# Altium project H3-core.PrjPcb
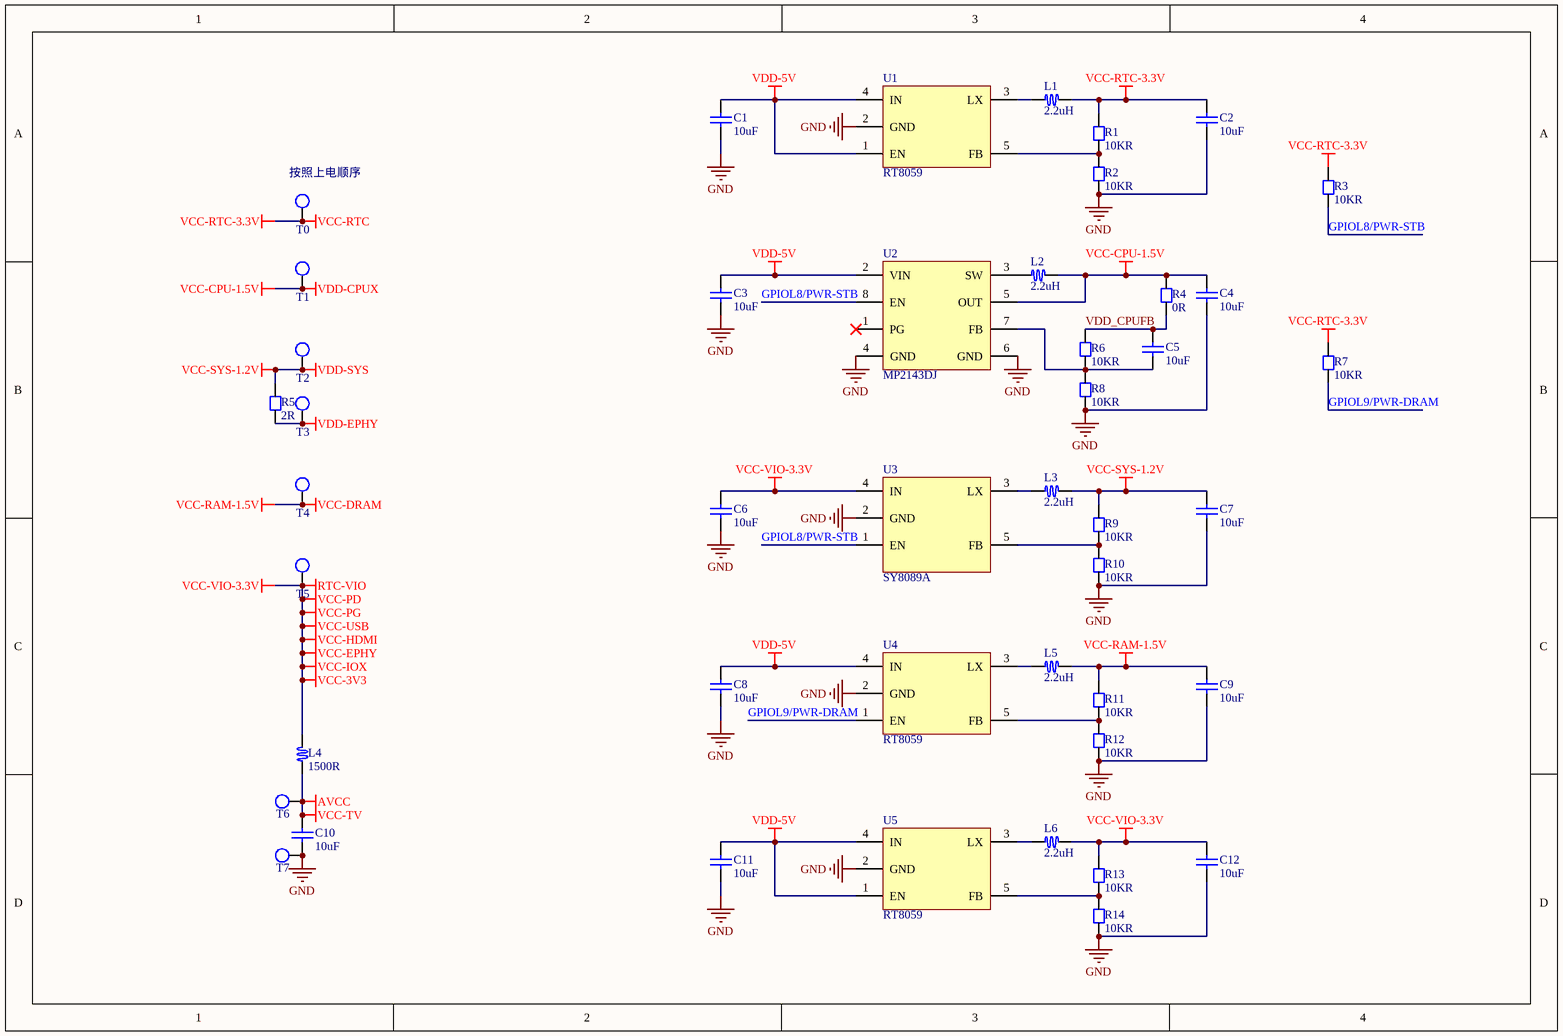
[diagram p0: 1-Power.SchDoc]
4 sheets, 165 parts. Net scope: global (net labels, ports and power ports of the same name join across sheets).
Board files: H3-core.PcbDoc, PCB-Logo.PcbDoc
Sheets:
  1-Power.SchDoc
  2-core.SchDoc
  3-Wifi-SD.SchDoc
  4-Connect.SchDoc

## Sheet 1-Power.SchDoc
size A4; SheetNumber: 1; SheetTotal: 4

### Parts
C1  10uF  [CC1005-0402]
C2  10uF  [CC1005-0402]
C3  10uF  [CC1005-0402]
C4  10uF  [CC1005-0402]
C5  10uF  [CC1005-0402]
C6  10uF  [CC1005-0402]
C7  10uF  [CC1005-0402]
C8  10uF  [CC1005-0402]
C9  10uF  [CC1005-0402]
C10  10uF  [CC1005-0402]
C11  10uF  [CC1005-0402]
C12  10uF  [CC1005-0402]
L1  2.2uH  [Inductor-3010]
L2  2.2uH  [Inductor-4018]
L3  2.2uH  [Inductor-3010]
L4  1500R  [Inductor-0402]
L5  2.2uH  [Inductor-3010]
L6  2.2uH  [Inductor-3010]
R1  10KR  [CR1005-0402]
R2  10KR  [CR1005-0402]
R3  10KR  [CR1005-0402]
R4  0R  [CR1005-0402]
R5  2R  [CR1005-0402]
R6  10KR  [CR1005-0402]
R7  10KR  [CR1005-0402]
R8  10KR  [CR1005-0402]
R9  10KR  [CR1005-0402]
R10  10KR  [CR1005-0402]
R11  10KR  [CR1005-0402]
R12  10KR  [CR1005-0402]
R13  10KR  [CR1005-0402]
R14  10KR  [CR1005-0402]
T0  Test  [TEST]  (value not drawn)
T1  Test  [TEST]  (value not drawn)
T2  Test  [TEST]  (value not drawn)
T3  Test  [TEST]  (value not drawn)
T4  Test  [TEST]  (value not drawn)
T5  Test  [TEST]  (value not drawn)
T6  Test  [TEST]  (value not drawn)
T7  Test  [TEST]  (value not drawn)
U1  RT8059  [SOT23-5]
U2  MP2143DJ  [TSOT23-8]
U3  SY8089A  [SOT23-5]
U4  RT8059  [SOT23-5]
U5  RT8059  [SOT23-5]

### Nets
AVCC: C10.2 L4.1 T6.1  [also labelled VCC-TV]
GND: C1.1 C2.1 C3.1 C4.1 C6.1 C7.1 C8.1 C9.1 C10.1 C11.1 C12.1 R2.1 R8.1 R10.1 R12.1 R14.1 T7.1 U1.2(GND) U2.4(GND) U2.6(GND) U3.2(GND) U4.2(GND) U5.2(GND)
RTC-VIO: C6.2 C12.2 L4.2 L6.2 R13.2 T5.1 U3.4(IN)  [also labelled VCC-3V3, VCC-EPHY, VCC-HDMI, VCC-IOX, VCC-PD, VCC-PG, VCC-USB, VCC-VIO-3.3V]
VCC-CPU-1.5V: C4.2 L2.2 R4.2 T1.1 U2.5(OUT)  [also labelled VDD-CPUX]
VCC-DRAM: C9.2 L5.2 R11.2 T4.1  [also labelled VCC-RAM-1.5V]
VCC-RTC: C2.2 L1.2 R1.2 R3.2 R7.2 T0.1  [also labelled VCC-RTC-3.3V]
VCC-SYS-1.2V: C7.2 L3.2 R5.1 R9.2 T2.1  [also labelled VDD-SYS]
VDD-5V: C1.2 C3.2 C8.2 C11.2 U1.1(EN) U1.4(IN) U2.2(VIN) U4.4(IN) U5.1(EN) U5.4(IN)  [project net USB-5V]
VDD-EPHY: R5.2 T3.1
GPIOL8/PWR-STB: R3.1 U2.8(EN) U3.1(EN)
GPIOL9/PWR-DRAM: R7.1 U4.1(EN)
VDD_CPUFB: C5.2 R4.1 R6.2
NetC5_1: C5.1 R6.1 R8.2 U2.7(FB)
NetL1_1: L1.1 U1.3(LX)
NetL2_1: L2.1 U2.3(SW)
NetL3_1: L3.1 U3.3(LX)
NetL5_1: L5.1 U4.3(LX)
NetL6_1: L6.1 U5.3(LX)
NetR1_1: R1.1 R2.2 U1.5(FB)
NetR9_1: R9.1 R10.2 U3.5(FB)
NetR11_1: R11.1 R12.2 U4.5(FB)
NetR13_1: R13.1 R14.2 U5.5(FB)

Not connected (* = marked no-connect by the designer): U2 1(PG)*

### Notes on the sheet
- (near T0) 按照上电顺序

### Library data of the parts
C1-C12 = Chip capacitor: 贴片电容
L1-L6 = Chip inductor: 贴片电感
R1-R14 = Chip resistor: 贴片电阻
T0-T7 = Test: 测试点
U1 U4 U5 = RT8059: LDO 1A RICHTEK(台湾立锜)
U2 = MP2143DJ: DCDC 3A MPS公司（中文名称：芯源信息系统有限公司）
U3 = SY8089A: DCDC 2A

## Sheet 2-core.SchDoc
size A2; SheetNumber: 2; SheetTotal: 4
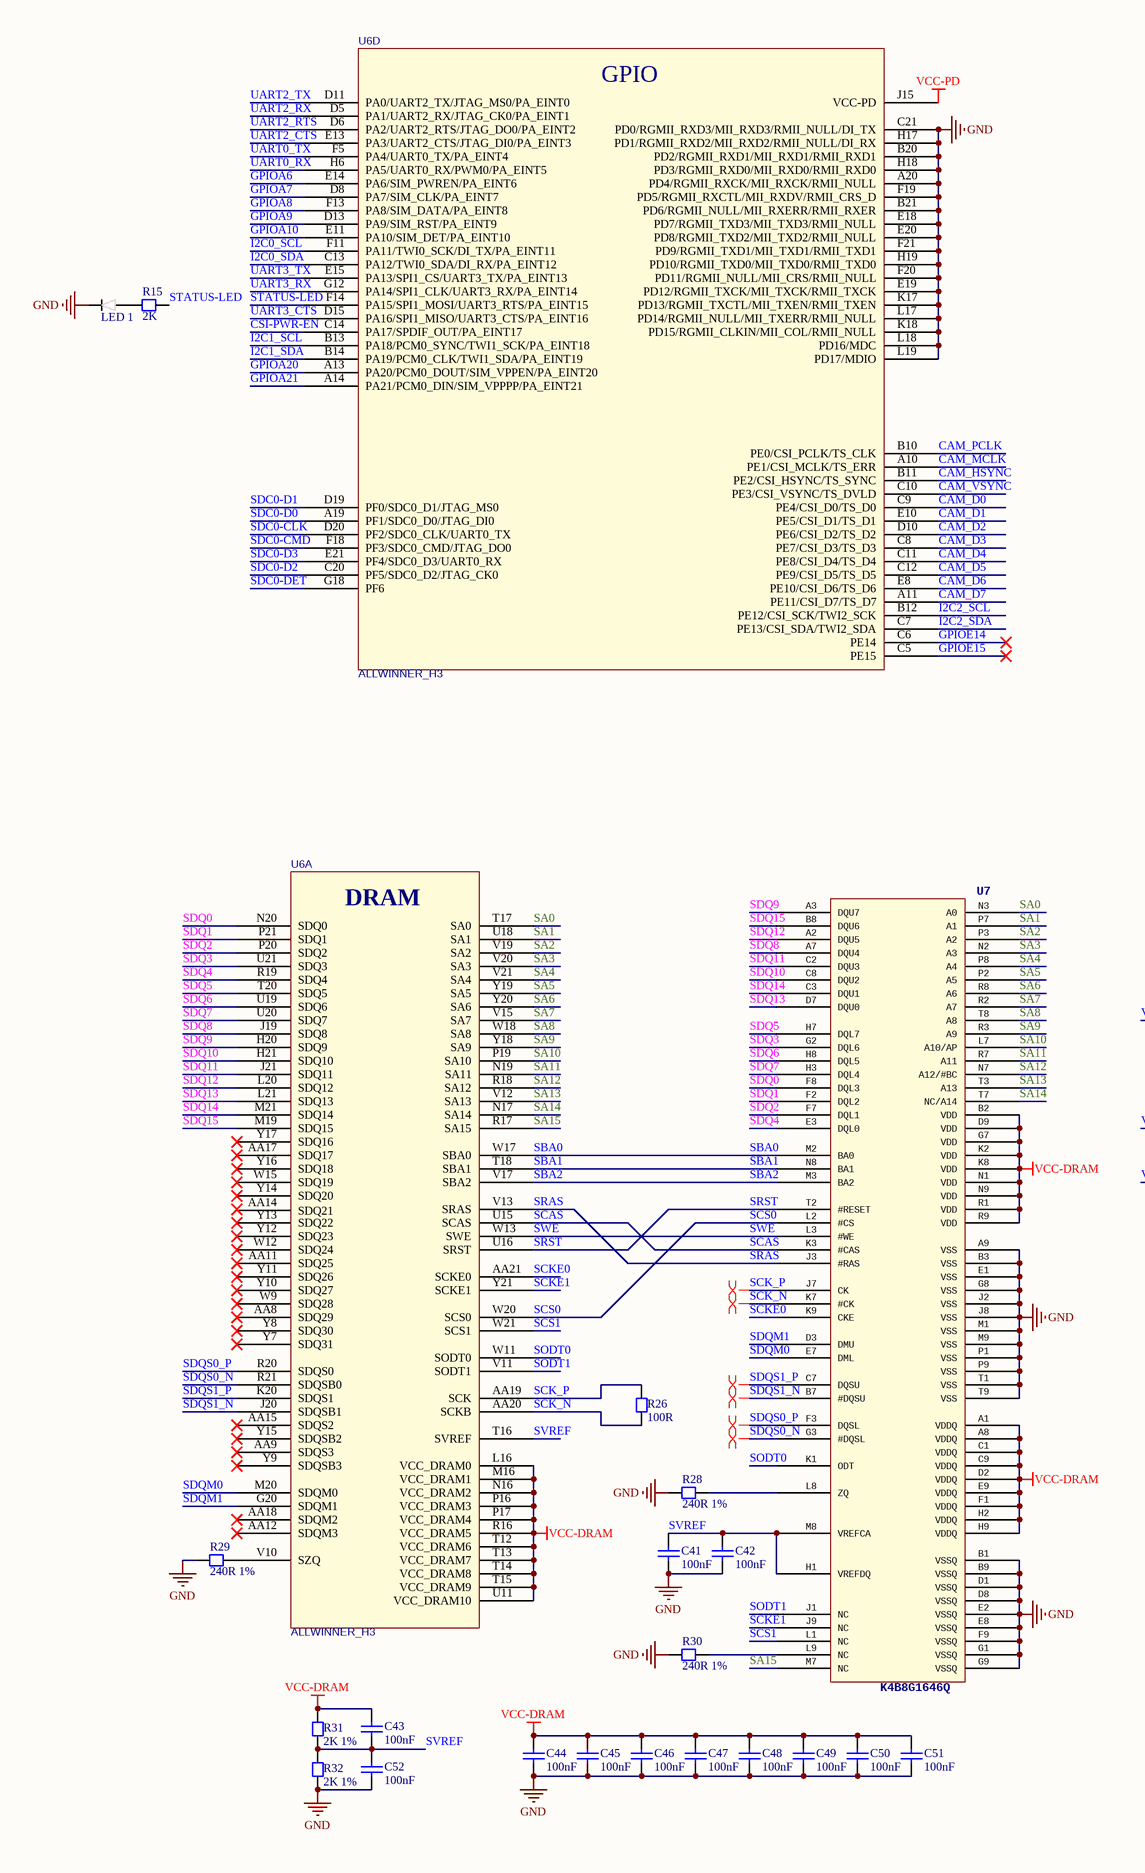
[diagram p1: 2-core.SchDoc, left]
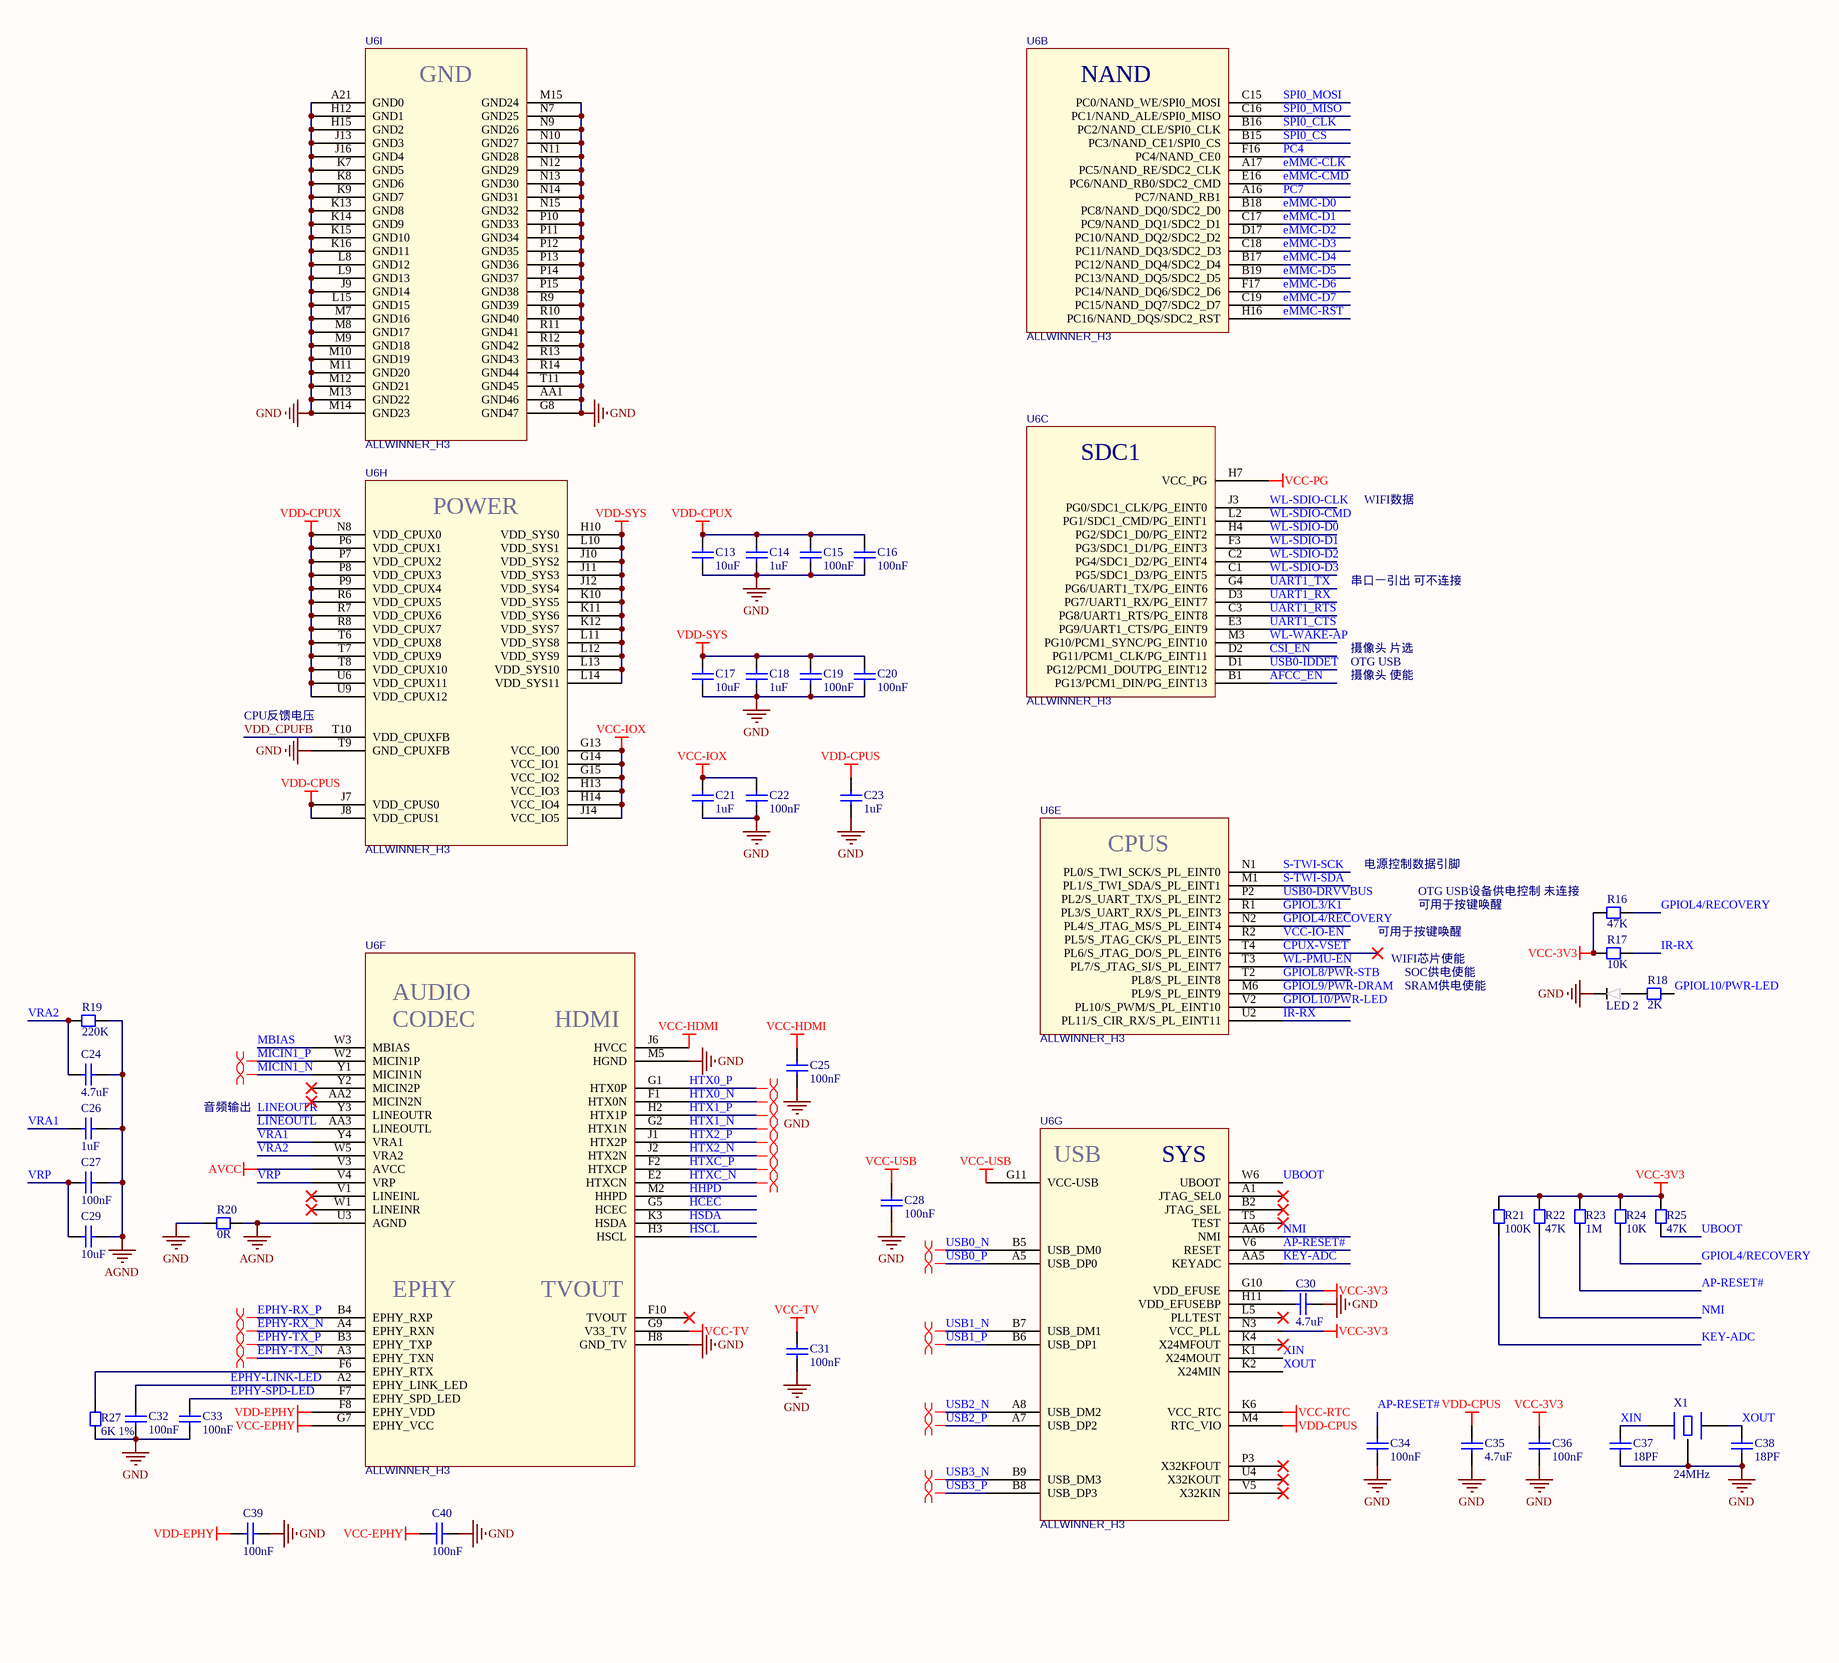
[diagram p2: 2-core.SchDoc, right]

### Parts
C13  10uF  [CC1005-0402]
C14  1uF  [CC1005-0402]
C15  100nF  [CC1005-0402]
C16  100nF  [CC1005-0402]
C17  10uF  [CC1005-0402]
C18  1uF  [CC1005-0402]
C19  100nF  [CC1005-0402]
C20  100nF  [CC1005-0402]
C21  1uF  [CC1005-0402]
C22  100nF  [CC1005-0402]
C23  1uF  [CC1005-0402]
C24  4.7uF  [CC1005-0402]
C25  100nF  [CC1005-0402]
C26  1uF  [CC1005-0402]
C27  100nF  [CC1005-0402]
C28  100nF  [CC1005-0402]
C29  10uF  [CC1005-0402]
C30  4.7uF  [CC1005-0402]
C31  100nF  [CC1005-0402]
C32  100nF  [CC1005-0402]
C33  100nF  [CC1005-0402]
C34  100nF  [CC1005-0402]
C35  4.7uF  [CC1005-0402]
C36  100nF  [CC1005-0402]
C37  18PF  [CC1005-0402]
C38  18PF  [CC1005-0402]
C39  100nF  [CC1005-0402]
C40  100nF  [CC1005-0402]
C41  100nF  [CC1005-0402]
C42  100nF  [CC1005-0402]
C43  100nF  [CC1005-0402]
C44  100nF  [CC1005-0402]
C45  100nF  [CC1005-0402]
C46  100nF  [CC1005-0402]
C47  100nF  [CC1005-0402]
C48  100nF  [CC1005-0402]
C49  100nF  [CC1005-0402]
C50  100nF  [CC1005-0402]
C51  100nF  [CC1005-0402]
C52  100nF  [CC1005-0402]
LED_1  LED 0603  [LED 0603]  (value not drawn)
LED_2  LED 0603  [LED 0603]  (value not drawn)
R15  2K  [CR1005-0402]
R16  47K  [CR1005-0402]
R17  10K  [CR1005-0402]
R18  2K  [CR1005-0402]
R19  220K  [CR1005-0402]
R20  0R  [CR1005-0402]
R21  100K  [CR1005-0402]
R22  47K  [CR1005-0402]
R23  1M  [CR1005-0402]
R24  10K  [CR1005-0402]
R25  47K  [CR1005-0402]
R26  100R  [CR1005-0402]
R27  6K 1%  [CR1005-0402]
R28  240R 1%  [CR1005-0402]
R29  240R 1%  [CR1005-0402]
R30  240R 1%  [CR1005-0402]
R31  2K 1%  [CR1005-0402]
R32  2K 1%  [CR1005-0402]
U6  ALLWINNER_H3  [ALLWINNER-H3]  (parts A,B,C,D,E,F,G,H,I of 9)
U7  K4B8G1646Q  [FBGA96]
X1  24MHz  [XTAL-3225]

### Nets
AGND: C24.1 C26.1 C27.1 C29.1 R19.2 R20.1 U6.U3(AGND)
AVCC: C31.2 U6.G9(V33_TV) U6.V3(AVCC)  [also labelled VCC-TV]
GND: C13.1 C14.1 C15.1 C16.1 C17.1 C18.1 C19.1 C20.1 C21.1 C22.1 C23.1 C25.1 C28.1 C30.1 C31.1 C32.1 C33.1 C34.2 C35.1 C36.2 C37.1 C38.1 C39.1 C40.1 C41.1 C42.1 C44.1 C45.1 C46.1 C47.1 C48.1 C49.1 C50.1 C51.1 C52.1 LED_1.2 LED_2.2 R20.2 R27.2 R28.2 R29.2 R30.2 R32.1 U6.A20(PD4/RGMII_RXCK/MII_RXCK/RMII_NULL) U6.A21(GND0) U6.AA1(GND46) U6.B20(PD2/RGMII_RXD1/MII_RXD1/RMII_RXD1) U6.B21(PD6/RGMII_NULL/MII_RXERR/RMII_RXER) U6.C21(PD0/RGMII_RXD3/MII_RXD3/RMII_NULL/DI_TX) U6.E18(PD7/RGMII_TXD3/MII_TXD3/RMII_NULL) U6.E19(PD12/RGMII_TXCK/MII_TXCK/RMII_TXCK) U6.E20(PD8/RGMII_TXD2/MII_TXD2/RMII_NULL) U6.F19(PD5/RGMII_RXCTL/MII_RXDV/RMII_CRS_D) U6.F20(PD11/RGMII_NULL/MII_CRS/RMII_NULL) U6.F21(PD9/RGMII_TXD1/MII_TXD1/RMII_TXD1) U6.G8(GND47) U6.H8(GND_TV) U6.H12(GND1) U6.H15(GND2) U6.H17(PD1/RGMII_RXD2/MII_RXD2/RMII_NULL/DI_RX) U6.H18(PD3/RGMII_RXD0/MII_RXD0/RMII_RXD0) U6.H19(PD10/RGMII_TXD0/MII_TXD0/RMII_TXD0) U6.J9(GND14) U6.J13(GND3) U6.J16(GND4) U6.K7(GND5) U6.K8(GND6) U6.K9(GND7) U6.K13(GND8) U6.K14(GND9) U6.K15(GND10) U6.K16(GND11) U6.K17(PD13/RGMII_TXCTL/MII_TXEN/RMII_TXEN) U6.K18(PD15/RGMII_CLKIN/MII_COL/RMII_NULL) U6.L8(GND12) U6.L9(GND13) U6.L15(GND15) U6.L17(PD14/RGMII_NULL/MII_TXERR/RMII_NULL) U6.L18(PD16/MDC) U6.L19(PD17/MDIO) U6.M5(HGND) U6.M7(GND16) U6.M8(GND17) U6.M9(GND18) U6.M10(GND19) U6.M11(GND20) U6.M12(GND21) U6.M13(GND22) U6.M14(GND23) U6.M15(GND24) U6.N7(GND25) U6.N9(GND26) U6.N10(GND27) U6.N11(GND28) U6.N12(GND29) U6.N13(GND30) U6.N14(GND31) U6.N15(GND32) U6.P10(GND33) U6.P11(GND34) U6.P12(GND35) U6.P13(GND36) U6.P14(GND37) U6.P15(GND38) U6.R9(GND39) U6.R10(GND40) U6.R11(GND41) U6.R12(GND42) U6.R13(GND43) U6.R14(GND44) U6.T9(GND_CPUXFB) U6.T11(GND45) U7.A9(VSS) U7.B1(VSSQ) U7.B3(VSS) U7.B9(VSSQ) U7.D1(VSSQ) U7.D8(VSSQ) U7.E1(VSS) U7.E2(VSSQ) U7.E8(VSSQ) U7.F9(VSSQ) U7.G1(VSSQ) U7.G8(VSS) U7.G9(VSSQ) U7.J2(VSS) U7.J8(VSS) U7.M1(VSS) U7.M9(VSS) U7.P1(VSS) U7.P9(VSS) U7.T1(VSS) U7.T9(VSS) X1.2(GND)
VCC-3V3: C21.2 C22.2 C25.2 C28.2 C36.1 C40.2 R16.1 R17.1 R21.1 R22.1 R23.1 R24.1 R25.1 U6.G7(EPHY_VCC) U6.G10(VDD_EFUSE) U6.G11(VCC-USB) U6.G13(VCC_IO0) U6.G14(VCC_IO1) U6.G15(VCC_IO2) U6.H7(VCC_PG) U6.H13(VCC_IO3) U6.H14(VCC_IO4) U6.J6(HVCC) U6.J14(VCC_IO5) U6.J15(VCC-PD) U6.N3(VCC_PLL)  [also labelled VCC-EPHY, VCC-HDMI, VCC-IOX, VCC-PD, VCC-PG, VCC-USB]  [project net RTC-VIO]
VCC-DRAM: C43.2 C44.2 C45.2 C46.2 C47.2 C48.2 C49.2 C50.2 C51.2 R31.2 U6.L16(VCC_DRAM0) U6.M16(VCC_DRAM1) U6.N16(VCC_DRAM2) U6.P16(VCC_DRAM3) U6.P17(VCC_DRAM4) U6.R16(VCC_DRAM5) U6.T12(VCC_DRAM6) U6.T13(VCC_DRAM7) U6.T14(VCC_DRAM8) U6.T15(VCC_DRAM9) U6.U11(VCC_DRAM10) U7.A1(VDDQ) U7.A8(VDDQ) U7.B2(VDD) U7.C1(VDDQ) U7.C9(VDDQ) U7.D2(VDDQ) U7.D9(VDD) U7.E9(VDDQ) U7.F1(VDDQ) U7.G7(VDD) U7.H2(VDDQ) U7.H9(VDDQ) U7.K2(VDD) U7.K8(VDD) U7.N1(VDD) U7.N9(VDD) U7.R1(VDD) U7.R9(VDD)
VCC-RTC: U6.K6(VCC_RTC)
VDD-CPUS: C23.2 C35.2 U6.J7(VDD_CPUS0) U6.J8(VDD_CPUS1) U6.M4(RTC_VIO)
VDD-CPUX: C13.2 C14.2 C15.2 C16.2 U6.N8(VDD_CPUX0) U6.P6(VDD_CPUX1) U6.P7(VDD_CPUX2) U6.P8(VDD_CPUX3) U6.P9(VDD_CPUX4) U6.R6(VDD_CPUX5) U6.R7(VDD_CPUX6) U6.R8(VDD_CPUX7) U6.T6(VDD_CPUX8) U6.T7(VDD_CPUX9) U6.T8(VDD_CPUX10) U6.U6(VDD_CPUX11) U6.U9(VDD_CPUX12)  [project net VCC-CPU-1.5V]
VDD-EPHY: C39.2 U6.F8(EPHY_VDD)
VDD-SYS: C17.2 C18.2 C19.2 C20.2 U6.H10(VDD_SYS0) U6.J10(VDD_SYS2) U6.J11(VDD_SYS3) U6.J12(VDD_SYS4) U6.K10(VDD_SYS5) U6.K11(VDD_SYS6) U6.K12(VDD_SYS7) U6.L10(VDD_SYS1) U6.L11(VDD_SYS8) U6.L12(VDD_SYS9) U6.L13(VDD_SYS10) U6.L14(VDD_SYS11)  [project net VCC-SYS-1.2V]
AFCC_EN: U6.B1(PG13/PCM1_DIN/PG_EINT13)
AP-RESET#: C34.1 R23.2 U6.V6(RESET)
CAM_D0: U6.C9(PE4/CSI_D0/TS_D0)
CAM_D1: U6.E10(PE5/CSI_D1/TS_D1)
CAM_D2: U6.D10(PE6/CSI_D2/TS_D2)
CAM_D3: U6.C8(PE7/CSI_D3/TS_D3)
CAM_D4: U6.C11(PE8/CSI_D4/TS_D4)
CAM_D5: U6.C12(PE9/CSI_D5/TS_D5)
CAM_D6: U6.E8(PE10/CSI_D6/TS_D6)
CAM_D7: U6.A11(PE11/CSI_D7/TS_D7)
CAM_HSYNC: U6.B11(PE2/CSI_HSYNC/TS_SYNC)
CAM_MCLK: U6.A10(PE1/CSI_MCLK/TS_ERR)
CAM_PCLK: U6.B10(PE0/CSI_PCLK/TS_CLK)
CAM_VSYNC: U6.C10(PE3/CSI_VSYNC/TS_DVLD)
CPUX-VSET: U6.T4(PL6/S_JTAG_DO/S_PL_EINT6)
CSI-PWR-EN: U6.C14(PA17/SPDIF_OUT/PA_EINT17)
CSI_EN: U6.D2(PG11/PCM1_CLK/PG_EINT11)
eMMC-CLK: U6.A17(PC5/NAND_RE/SDC2_CLK)
eMMC-CMD: U6.E16(PC6/NAND_RB0/SDC2_CMD)
eMMC-D0: U6.B18(PC8/NAND_DQ0/SDC2_D0)
eMMC-D1: U6.C17(PC9/NAND_DQ1/SDC2_D1)
eMMC-D2: U6.D17(PC10/NAND_DQ2/SDC2_D2)
eMMC-D3: U6.C18(PC11/NAND_DQ3/SDC2_D3)
eMMC-D4: U6.B17(PC12/NAND_DQ4/SDC2_D4)
eMMC-D5: U6.B19(PC13/NAND_DQ5/SDC2_D5)
eMMC-D6: U6.F17(PC14/NAND_DQ6/SDC2_D6)
eMMC-D7: U6.C19(PC15/NAND_DQ7/SDC2_D7)
eMMC-RST: U6.H16(PC16/NAND_DQS/SDC2_RST)
EPHY-LINK-LED: C32.2 U6.A2(EPHY_LINK_LED)
EPHY-RX_N: U6.A4(EPHY_RXN)
EPHY-RX_P: U6.B4(EPHY_RXP)
EPHY-SPD-LED: C33.2 U6.F7(EPHY_SPD_LED)
EPHY-TX_N: U6.A3(EPHY_TXN)
EPHY-TX_P: U6.B3(EPHY_TXP)
GPIOA6: U6.E14(PA6/SIM_PWREN/PA_EINT6)
GPIOA7: U6.D8(PA7/SIM_CLK/PA_EINT7)
GPIOA8: U6.F13(PA8/SIM_DATA/PA_EINT8)
GPIOA9: U6.D13(PA9/SIM_RST/PA_EINT9)
GPIOA10: U6.E11(PA10/SIM_DET/PA_EINT10)
GPIOA20: U6.A13(PA20/PCM0_DOUT/SIM_VPPEN/PA_EINT20)
GPIOA21: U6.A14(PA21/PCM0_DIN/SIM_VPPPP/PA_EINT21)
GPIOE14: U6.C6(PE14)
GPIOE15: U6.C5(PE15)
GPIOL3/K1: U6.R1(PL3/S_UART_RX/S_PL_EINT3)
GPIOL4/RECOVERY: R16.2 R24.2 U6.N2(PL4/S_JTAG_MS/S_PL_EINT4)
GPIOL8/PWR-STB: U6.T2(PL8/S_PL_EINT8)
GPIOL9/PWR-DRAM: U6.M6(PL9/S_PL_EINT9)
GPIOL10/PWR-LED: R18.1 U6.V2(PL10/S_PWM/S_PL_EINT10)
HCEC: U6.G5(HCEC)
HHPD: U6.M2(HHPD)
HSCL: U6.H3(HSCL)
HSDA: U6.K3(HSDA)
HTX0_N: U6.F1(HTX0N)
HTX0_P: U6.G1(HTX0P)
HTX1_N: U6.G2(HTX1N)
HTX1_P: U6.H2(HTX1P)
HTX2_N: U6.J2(HTX2N)
HTX2_P: U6.J1(HTX2P)
HTXC_N: U6.E2(HTXCN)
HTXC_P: U6.F2(HTXCP)
I2C0_SCL: U6.F11(PA11/TWI0_SCK/DI_TX/PA_EINT11)
I2C0_SDA: U6.C13(PA12/TWI0_SDA/DI_RX/PA_EINT12)
I2C1_SCL: U6.B13(PA18/PCM0_SYNC/TWI1_SCK/PA_EINT18)
I2C1_SDA: U6.B14(PA19/PCM0_CLK/TWI1_SDA/PA_EINT19)
I2C2_SCL: U6.B12(PE12/CSI_SCK/TWI2_SCK)
I2C2_SDA: U6.C7(PE13/CSI_SDA/TWI2_SDA)
IR-RX: R17.2 U6.U2(PL11/S_CIR_RX/S_PL_EINT11)
KEY-ADC: R21.2 U6.AA5(KEYADC)
LINEOUTL: U6.AA3(LINEOUTL)
LINEOUTR: U6.Y3(LINEOUTR)
MBIAS: U6.W3(MBIAS)
MICIN1_N: U6.Y1(MICIN1N)
MICIN1_P: U6.W2(MICIN1P)
NMI: R22.2 U6.AA6(NMI)
PC4: U6.F16(PC4/NAND_CE0)
PC7: U6.A16(PC7/NAND_RB1)
S-TWI-SCK: U6.N1(PL0/S_TWI_SCK/S_PL_EINT0)
S-TWI-SDA: U6.M1(PL1/S_TWI_SDA/S_PL_EINT1)
SA0: U6.T17(SA0) U7.N3(A0)
SA1: U6.U18(SA1) U7.P7(A1)
SA2: U6.V19(SA2) U7.P3(A2)
SA3: U6.V20(SA3) U7.N2(A3)
SA4: U6.V21(SA4) U7.P8(A4)
SA5: U6.Y19(SA5) U7.P2(A5)
SA6: U6.Y20(SA6) U7.R8(A6)
SA7: U6.V15(SA7) U7.R2(A7)
SA8: U6.W18(SA8) U7.T8(A8)
SA9: U6.Y18(SA9) U7.R3(A9)
SA10: U6.P19(SA10) U7.L7(A10/AP)
SA11: U6.N19(SA11) U7.R7(A11)
SA12: U6.R18(SA12) U7.N7(A12/#BC)
SA13: U6.V12(SA13) U7.T3(A13)
SA14: U6.N17(SA14) U7.T7(NC/A14)
SA15: U6.R17(SA15) U7.M7(NC)
SBA0: U6.W17(SBA0) U7.M2(BA0)
SBA1: U6.T18(SBA1) U7.N8(BA1)
SBA2: U6.V17(SBA2) U7.M3(BA2)
SCAS: U6.U15(SCAS) U7.K3(#CAS)
SCK_N: R26.2 U6.AA20(SCKB) U7.K7(#CK)
SCK_P: R26.1 U6.AA19(SCK) U7.J7(CK)
SCKE0: U6.AA21(SCKE0) U7.K9(CKE)
SCKE1: U6.Y21(SCKE1) U7.J9(NC)
SCS0: U6.W20(SCS0) U7.L2(#CS)
SCS1: U6.W21(SCS1) U7.L1(NC)
SDC0-CLK: U6.D20(PF2/SDC0_CLK/UART0_TX)
SDC0-CMD: U6.F18(PF3/SDC0_CMD/JTAG_DO0)
SDC0-D0: U6.A19(PF1/SDC0_D0/JTAG_DI0)
SDC0-D1: U6.D19(PF0/SDC0_D1/JTAG_MS0)
SDC0-D2: U6.C20(PF5/SDC0_D2/JTAG_CK0)
SDC0-D3: U6.E21(PF4/SDC0_D3/UART0_RX)
SDC0-DET: U6.G18(PF6)
SDQ0: U6.N20(SDQ0) U7.F8(DQL3)
SDQ1: U6.P21(SDQ1) U7.F2(DQL2)
SDQ2: U6.P20(SDQ2) U7.F7(DQL1)
SDQ3: U6.U21(SDQ3) U7.G2(DQL6)
SDQ4: U6.R19(SDQ4) U7.E3(DQL0)
SDQ5: U6.T20(SDQ5) U7.H7(DQL7)
SDQ6: U6.U19(SDQ6) U7.H8(DQL5)
SDQ7: U6.U20(SDQ7) U7.H3(DQL4)
SDQ8: U6.J19(SDQ8) U7.A7(DQU4)
SDQ9: U6.H20(SDQ9) U7.A3(DQU7)
SDQ10: U6.H21(SDQ10) U7.C8(DQU2)
SDQ11: U6.J21(SDQ11) U7.C2(DQU3)
SDQ12: U6.L20(SDQ12) U7.A2(DQU5)
SDQ13: U6.L21(SDQ13) U7.D7(DQU0)
SDQ14: U6.M21(SDQ14) U7.C3(DQU1)
SDQ15: U6.M19(SDQ15) U7.B8(DQU6)
SDQM0: U6.M20(SDQM0) U7.E7(DML)
SDQM1: U6.G20(SDQM1) U7.D3(DMU)
SDQS0_N: U6.R21(SDQSB0) U7.G3(#DQSL)
SDQS0_P: U6.R20(SDQS0) U7.F3(DQSL)
SDQS1_N: U6.J20(SDQSB1) U7.B7(#DQSU)
SDQS1_P: U6.K20(SDQS1) U7.C7(DQSU)
SODT0: U6.W11(SODT0) U7.K1(ODT)
SODT1: U6.V11(SODT1) U7.J1(NC)
SPI0_CLK: U6.B16(PC2/NAND_CLE/SPI0_CLK)
SPI0_CS: U6.B15(PC3/NAND_CE1/SPI0_CS)
SPI0_MISO: U6.C16(PC1/NAND_ALE/SPI0_MISO)
SPI0_MOSI: U6.C15(PC0/NAND_WE/SPI0_MOSI)
SRAS: U6.V13(SRAS) U7.J3(#RAS)
SRST: U6.U16(SRST) U7.T2(#RESET)
STATUS-LED: R15.1 U6.F14(PA15/SPI1_MOSI/UART3_RTS/PA_EINT15)
SVREF: C41.2 C42.2 C43.1 C52.2 R31.1 R32.2 U6.T16(SVREF) U7.H1(VREFDQ) U7.M8(VREFCA)
SWE: U6.W13(SWE) U7.L3(#WE)
UART0_RX: U6.H6(PA5/UART0_RX/PWM0/PA_EINT5)
UART0_TX: U6.F5(PA4/UART0_TX/PA_EINT4)
UART1_CTS: U6.E3(PG9/UART1_CTS/PG_EINT9)
UART1_RTS: U6.C3(PG8/UART1_RTS/PG_EINT8)
UART1_RX: U6.D3(PG7/UART1_RX/PG_EINT7)
UART1_TX: U6.G4(PG6/UART1_TX/PG_EINT6)
UART2_CTS: U6.E13(PA3/UART2_CTS/JTAG_DI0/PA_EINT3)
UART2_RTS: U6.D6(PA2/UART2_RTS/JTAG_DO0/PA_EINT2)
UART2_RX: U6.D5(PA1/UART2_RX/JTAG_CK0/PA_EINT1)
UART2_TX: U6.D11(PA0/UART2_TX/JTAG_MS0/PA_EINT0)
UART3_CTS: U6.D15(PA16/SPI1_MISO/UART3_CTS/PA_EINT16)
UART3_RX: U6.G12(PA14/SPI1_CLK/UART3_RX/PA_EINT14)
UART3_TX: U6.E15(PA13/SPI1_CS/UART3_TX/PA_EINT13)
UBOOT: R25.2 U6.W6(UBOOT)
USB0-DRVVBUS: U6.P2(PL2/S_UART_TX/S_PL_EINT2)
USB0-IDDET: U6.D1(PG12/PCM1_DOUTPG_EINT12)
USB0_N: U6.B5(USB_DM0)
USB0_P: U6.A5(USB_DP0)
USB1_N: U6.B7(USB_DM1)
USB1_P: U6.B6(USB_DP1)
USB2_N: U6.A8(USB_DM2)
USB2_P: U6.A7(USB_DP2)
USB3_N: U6.B9(USB_DM3)
USB3_P: U6.B8(USB_DP3)
VCC-IO-EN: U6.R2(PL5/S_JTAG_CK/S_PL_EINT5)
VDD_CPUFB: U6.T10(VDD_CPUXFB)
VRA1: C26.2 U6.Y4(VRA1)
VRA2: C24.2 R19.1 U6.W5(VRA2)
VRP: C27.2 C29.2 U6.V4(VRP)
WL-PMU-EN: U6.T3(PL7/S_JTAG_SI/S_PL_EINT7)
WL-SDIO-CLK: U6.J3(PG0/SDC1_CLK/PG_EINT0)
WL-SDIO-CMD: U6.L2(PG1/SDC1_CMD/PG_EINT1)
WL-SDIO-D0: U6.H4(PG2/SDC1_D0/PG_EINT2)
WL-SDIO-D1: U6.F3(PG3/SDC1_D1/PG_EINT3)
WL-SDIO-D2: U6.C2(PG4/SDC1_D2/PG_EINT4)
WL-SDIO-D3: U6.C1(PG5/SDC1_D3/PG_EINT5)
WL-WAKE-AP: U6.M3(PG10/PCM1_SYNC/PG_EINT10)
XIN: C37.2 U6.K1(X24MOUT) X1.1(OSC1)
XOUT: C38.2 U6.K2(X24MIN) X1.3(OSC2)
NetC30_2: C30.2 U6.H11(VDD_EFUSEBP)
NetLED_1_1: LED_1.1 R15.2
NetLED_2_1: LED_2.1 R18.2
NetR27_1: R27.1 U6.F6(EPHY_RTX)
NetR28_1: R28.1 U7.L8(ZQ)
NetR29_1: R29.1 U6.V10(SZQ)
NetR30_1: R30.1 U7.L9(NC)

Not connected (* = marked no-connect by the designer): U6 A1(JTAG_SEL0)* AA2(MICIN2N)* AA8(SDQ29)* AA9(SDQS3)* AA11(SDQ25)* AA12(SDQM3)* AA14(SDQ21) AA15(SDQS2)* AA17(SDQ17)* AA18(SDQM2)* B2(JTAG_SEL)* F10(TVOUT)* K4(X24MFOUT)* L5(PLLTEST)* P3(X32KFOUT)* T5(TEST)* U4(X32KOUT)* V1(LINEINL)* V5(X32KIN)* W1(LINEINR)* W9(SDQ28)* W12(SDQ24)* W15(SDQ19)* Y2(MICIN2P)* Y7(SDQ31)* Y8(SDQ30)* Y9(SDQSB3)* Y10(SDQ27)* Y11(SDQ26)* Y12(SDQ23)* Y13(SDQ22)* Y14(SDQ20)* Y15(SDQSB2)* Y16(SDQ18)* Y17(SDQ16)*

### Layout directives
differential pair: EPHY-RX_N, EPHY-RX_P, EPHY-TX_N, EPHY-TX_P, HTX0_N, HTX0_P, HTX1_N, HTX1_P, HTX2_N, HTX2_P, HTXC_N, HTXC_P, MICIN1_N, MICIN1_P, SCK_N, SCK_P, SDQS0_N, SDQS0_P, SDQS1_N, SDQS1_P, USB0_N, USB0_P, USB1_N, USB1_P, USB2_N, USB2_P, USB3_N, USB3_P

### Notes on the sheet
- WIFI数据
- 串口一引出 可不连接
- OTG USB
- 摄像头 片选
- CPU反馈电压
- 摄像头 使能
- 电源控制数据引脚
- 可用于按键唤醒
- OTG USB设备供电控制 未连接
- WIFI芯片使能
- SOC供电使能
- SRAM供电使能
- 音频输出
- (near U7) Bank地址输入(bank address inputs):指示被ACTIVTE，READ，
  WRITE或者PRECHARGE命令操作的Bank。另外用作指示在MODE REGISTER
  SET命令期间要访问的模式寄存器
- (near U7) 数据选通:输入用于写数据输出用于读数据。与输出数据边沿对
  齐，与输入数据中心对齐，DQS用于x4，x8，DQSU用于x16高8位，
  DQSL用于x16低8位。DDR4只支持差分数据选通，不支持单端数据
  选通道。
- (in symbol H3, part A) DRAM
- (in symbol H3, part B) NAND
- (in symbol H3, part C) SDC1
- (in symbol H3, part D) GPIO
- (in symbol H3, part E) CPUS
- (in symbol H3, part F) AUDIO; CODEC; HDMI; EPHY
- (in symbol H3, part G) USB; SYS
- (in symbol H3, part H) POWER
- (in symbol H3, part I) GND

### Library data of the parts
C13-C52 = Chip capacitor: 贴片电容
R15-R32 = Chip resistor: 贴片电阻
U6 = H3: 全志 双核A9 SOC; subpart_no: 1; Contributor: Think0; spicePre: U; spiceSymbolName: ALLWINNER_H3
U7 = K4B8G1646Q: DDR3 512M MYK0(FBGA-96_512MX16_DDR3-1600)
X1 = XTAL 3225: 3225封装的晶振

## Sheet 3-Wifi-SD.SchDoc
size A4; SheetNumber: 3; SheetTotal: 4
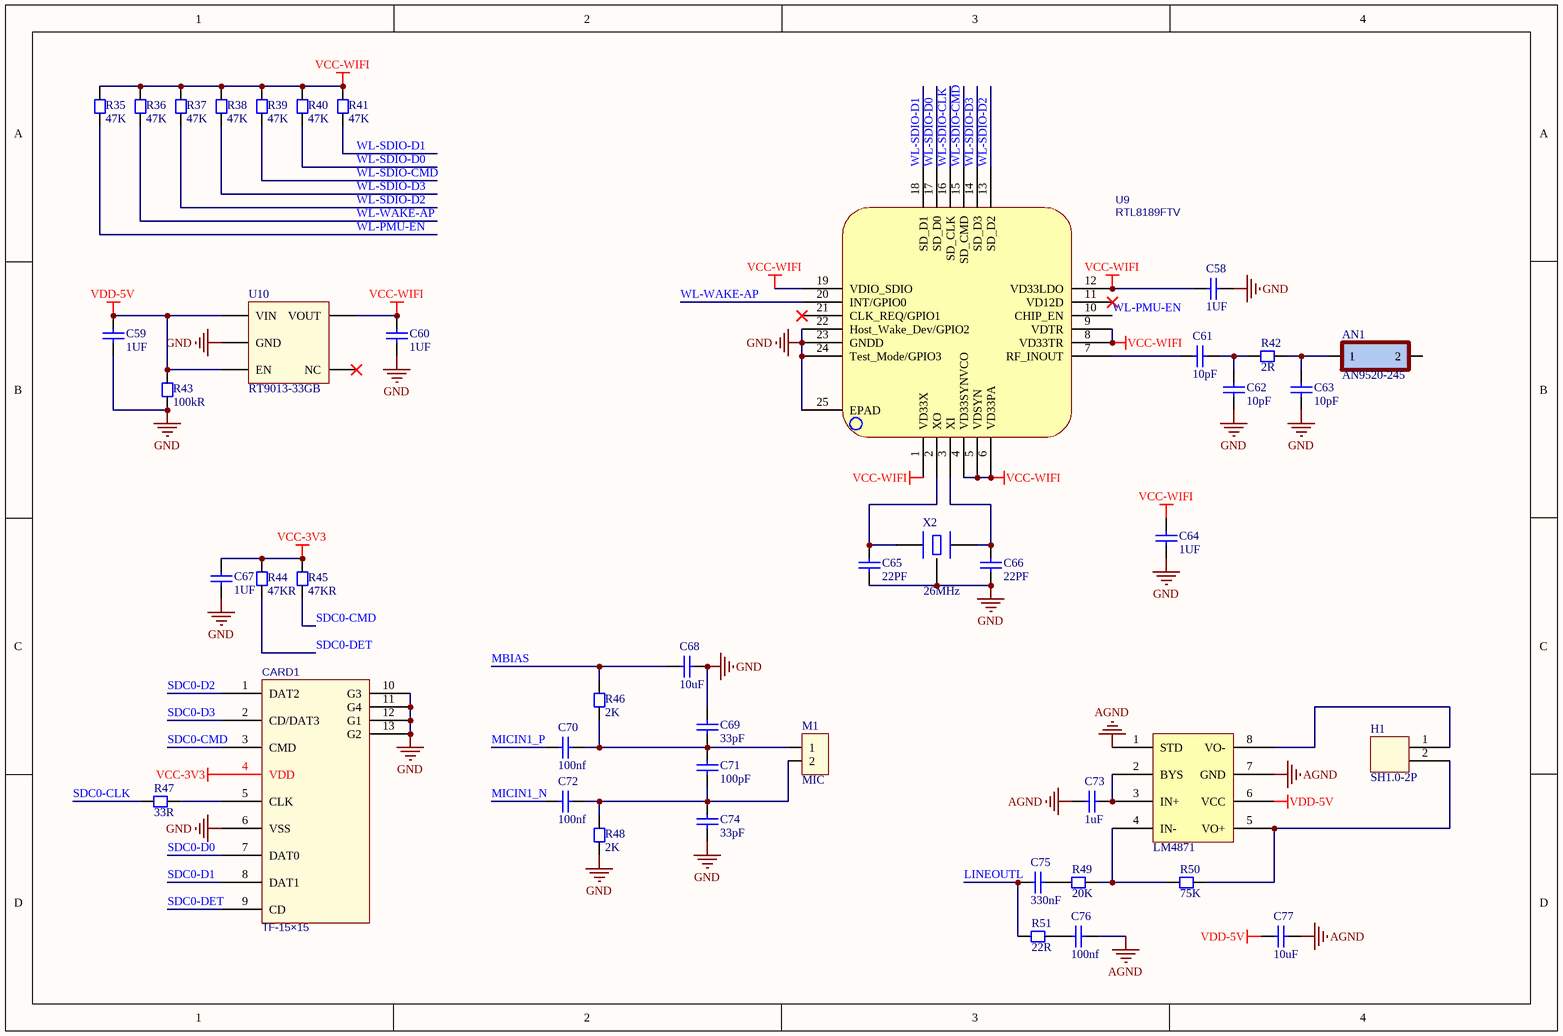
[diagram p3: 3-Wifi-SD.SchDoc]

### Parts
AN1  AN9520-245  [AN-5120]
C58  1UF  [CC1005-0402]
C59  1UF  [CC1005-0402]
C60  1UF  [CC1005-0402]
C61  10pF  [CC1005-0402]
C62  10pF  [CC1005-0402]
C63  10pF  [CC1005-0402]
C64  1UF  [CC1005-0402]
C65  22PF  [CC1005-0402]
C66  22PF  [CC1005-0402]
C67  1UF  [CC1005-0402]
C68  10uF  [CC1608-0603]
C69  33pF  [CC1005-0402]
C70  100nf  [CC1005-0402]
C71  100pF  [CC1005-0402]
C72  100nf  [CC1005-0402]
C73  1uF  [CC1005-0402]
C74  33pF  [CC1005-0402]
C75  330nF  [CC1005-0402]
C76  100nf  [CC1005-0402]
C77  10uF  [CC1608-0603]
CARD1  TF-15×15  [TF-SMD_TF-15-15]
H1  SH1.0-2P  [SH1.0-2P]
M1  MIC  [MIC6*2.2mm]
R35  47K  [CR1005-0402]
R36  47K  [CR1005-0402]
R37  47K  [CR1005-0402]
R38  47K  [CR1005-0402]
R39  47K  [CR1005-0402]
R40  47K  [CR1005-0402]
R41  47K  [CR1005-0402]
R42  2R  [CR1005-0402]
R43  100kR  [CR1005-0402]
R44  47KR  [CR1005-0402]
R45  47KR  [CR1005-0402]
R46  2K  [CR1005-0402]
R47  33R  [CR1005-0402]
R48  2K  [CR1005-0402]
R49  20K  [CR1005-0402]
R50  75K  [CR1005-0402]
R51  22R  [CR1005-0402]
U0  LM4871  [MSOP-8]
U9  RTL8189FTV  [QFN24-0404-.5]
U10  RT9013-33GB  [SOT23-5]
X2  26MHz  [XTAL-3225]

### Nets
AGND: C73.1 C76.1 C77.1 U0.1(STD) U0.7(GND)
GND: C58.2 C59.2 C60.2 C62.2 C63.2 C64.2 C65.1 C66.1 C67.2 C68.1 C69.1 C74.2 CARD1.6(VSS) CARD1.10(G3) CARD1.11(G4) CARD1.12(G1) CARD1.13(G2) R43.1 R48.1 U9.22(Host_Wake_Dev/GPIO2) U9.23(GNDD) U9.24(Test_Mode/GPIO3) U9.25(EPAD) U10.2(GND) X2.2(GND)
VCC-3V3: C67.1 CARD1.4(VDD) R44.2 R45.2  [project net RTC-VIO]
VCC-WIFI: C58.1 C60.1 C64.1 R35.2 R36.2 R37.2 R38.2 R39.2 R40.2 R41.2 U9.1(VD33X) U9.4(VD33SYNVCO) U9.5(VDSYN) U9.6(VD33PA) U9.8(VD33TR) U9.9(VDTR) U9.12(VD33LDO) U9.19(VDIO_SDIO) U10.5(VOUT)
VDD-5V: C59.1 C77.2 R43.2 U0.6(VCC) U10.1(VIN) U10.3(EN)  [project net USB-5V]
LINEOUTL: C75.1 R51.1
MBIAS: C68.2 R46.2
MICIN1_N: C72.2
MICIN1_P: C70.2
SDC0-CLK: R47.2
SDC0-CMD: CARD1.3(CMD) R45.1
SDC0-D0: CARD1.7(DAT0)
SDC0-D1: CARD1.8(DAT1)
SDC0-D2: CARD1.1(DAT2)
SDC0-D3: CARD1.2(CD/DAT3)
SDC0-DET: CARD1.9(CD) R44.1
WL-PMU-EN: R35.1 U9.10(CHIP_EN)
WL-SDIO-CLK: U9.16(SD_CLK)
WL-SDIO-CMD: R39.1 U9.15(SD_CMD)
WL-SDIO-D0: R40.1 U9.17(SD_D0)
WL-SDIO-D1: R41.1 U9.18(SD_D1)
WL-SDIO-D2: R37.1 U9.13(SD_D2)
WL-SDIO-D3: R38.1 U9.14(SD_D3)
WL-WAKE-AP: R36.1 U9.20(INT/GPIO0)
NetAN1_1: AN1.1 C63.1 R42.2
NetC61_1: C61.1 C62.1 R42.1
NetC61_2: C61.2 U9.7(RF_INOUT)
NetC65_2: C65.2 U9.2(XO) X2.1(OSC1)
NetC66_2: C66.2 U9.3(XI) X2.3(OSC2)
NetC69_2: C69.2 C70.1 C71.1 M1.1 R46.1
NetC71_2: C71.2 C72.1 C74.1 M1.2 R48.2
NetC73_2: C73.2 U0.2(BYS) U0.3(IN+)
NetC75_2: C75.2 R49.2
NetC76_2: C76.2 R51.2
NetCARD1_5: CARD1.5(CLK) R47.1
NetH1_1: H1.1 U0.8(VO-)
NetH1_2: H1.2 R50.1 U0.5(VO+)
NetR49_1: R49.1 R50.2 U0.4(IN-)

Not connected (* = marked no-connect by the designer): AN1 2; U9 11(VD12D)* 21(CLK_REQ/GPIO1)*; U10 4(NC)*

### Library data of the parts
AN1 = AN9520-245: 2.4G全向天线 蓝牙天线 陶瓷贴片 WIFI内置
C58-C77 = Chip capacitor: 贴片电容
CARD1 = TF-15×15: TF卡卡座 https://item.szlcsc.com/112422.html; BOM_Manufacturer: SOFNG; BOM_Supplier: LCSC; BOM_Manufacturer Part: TF-15×15; BOM_Supplier Part: C111196; BOM_JLCPCB Part Class: Extended Part; spicePre: C; spiceSymbolName: TF-15×15
M1 = MIC: 驻体麦克风
R35-R51 = Chip resistor: 贴片电阻
U0 = LM4871: 单通道音频放大器
U9 = RTL8189FTV: Contributor: Pythoniot; spicePre: U; spiceSymbolName: RTL8189FTV
U10 = RT9013-33GB: LDO 2.2-5.2V IN 500Ma OUT SOT23-5
X2 = XTAL 3225: 3225封装的晶振

## Sheet 4-Connect.SchDoc
size A4; SheetNumber: 4; SheetTotal: 4
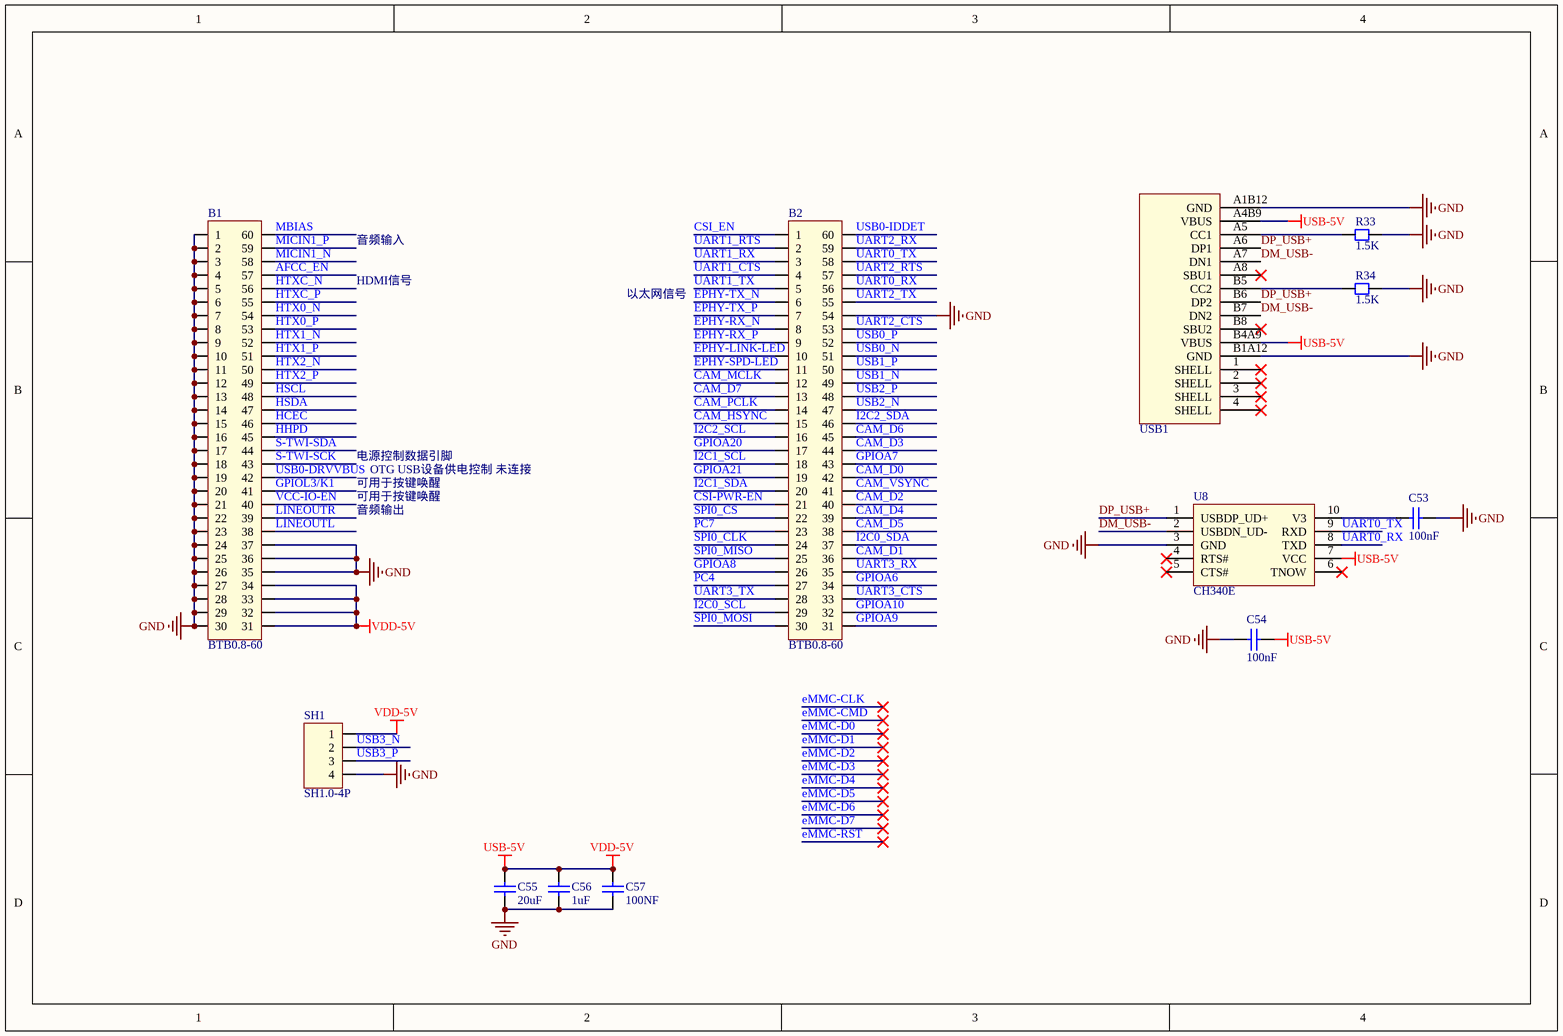
[diagram p4: 4-Connect.SchDoc]

### Parts
B1  BTB0.8-60  [BTB0.8-60-SMD]
B2  BTB0.8-60  [BTB0.8-60-SMD]
C53  100nF  [CC1005-0402]
C54  100nF  [CC1005-0402]
C55  20uF  [CC2012-0805]
C56  1uF  [CC2012-0805]
C57  100NF  [CC2012-0805]
R33  1.5K  [CR1005-0402]
R34  1.5K  [CR1005-0402]
SH1  SH1.0-4P  [SH1.0-4P]
U8  CH340E  [MSOP-10]
USB1  Tpye-c 16P  [TYPE-C 16P]  (value not drawn)

### Nets
GND: B1.1 B1.2 B1.3 B1.4 B1.5 B1.6 B1.7 B1.8 B1.9 B1.10 B1.11 B1.12 B1.13 B1.14 B1.15 B1.16 B1.17 B1.18 B1.19 B1.20 B1.21 B1.22 B1.23 B1.24 B1.25 B1.26 B1.27 B1.28 B1.29 B1.30 B1.35 B1.36 B1.37 B2.54 C53.2 C54.1 C55.1 C56.1 C57.1 R33.1 R34.1 SH1.4 U8.3(GND) USB1.A1B12(GND) USB1.B1A12(GND)
USB-5V: B1.31 B1.32 B1.33 B1.34 C54.2 C55.2 C56.2 C57.2 SH1.1 U8.7(VCC) USB1.A4B9(VBUS) USB1.B4A9(VBUS)  [also labelled VDD-5V]
AFCC_EN: B1.57
CAM_D0: B2.42
CAM_D1: B2.36
CAM_D2: B2.40
CAM_D3: B2.44
CAM_D4: B2.39
CAM_D5: B2.38
CAM_D6: B2.45
CAM_D7: B2.13
CAM_HSYNC: B2.15
CAM_MCLK: B2.12
CAM_PCLK: B2.14
CAM_VSYNC: B2.41
CSI-PWR-EN: B2.21
CSI_EN: B2.1
DM_USB-: U8.2(USBDN_UD-) USB1.A7(DN1) USB1.B7(DN2)
DP_USB+: U8.1(USBDP_UD+) USB1.A6(DP1) USB1.B6(DP2)
EPHY-LINK-LED: B2.10
EPHY-RX_N: B2.8
EPHY-RX_P: B2.9
EPHY-SPD-LED: B2.11
EPHY-TX_N: B2.6
EPHY-TX_P: B2.7
GPIOA6: B2.34
GPIOA7: B2.43
GPIOA8: B2.26
GPIOA9: B2.31
GPIOA10: B2.32
GPIOA20: B2.17
GPIOA21: B2.19
GPIOL3/K1: B1.41
HCEC: B1.46
HHPD: B1.45
HSCL: B1.48
HSDA: B1.47
HTX0_N: B1.54
HTX0_P: B1.53
HTX1_N: B1.52
HTX1_P: B1.51
HTX2_N: B1.50
HTX2_P: B1.49
HTXC_N: B1.56
HTXC_P: B1.55
I2C0_SCL: B2.29
I2C0_SDA: B2.37
I2C1_SCL: B2.18
I2C1_SDA: B2.20
I2C2_SCL: B2.16
I2C2_SDA: B2.46
LINEOUTL: B1.38
LINEOUTR: B1.39
MBIAS: B1.60
MICIN1_N: B1.58
MICIN1_P: B1.59
PC4: B2.27
PC7: B2.23
S-TWI-SCK: B1.43
S-TWI-SDA: B1.44
SPI0_CLK: B2.24
SPI0_CS: B2.22
SPI0_MISO: B2.25
SPI0_MOSI: B2.30
UART0_RX: B2.56 U8.8(TXD)
UART0_TX: B2.58 U8.9(RXD)
UART1_CTS: B2.4
UART1_RTS: B2.2
UART1_RX: B2.3
UART1_TX: B2.5
UART2_CTS: B2.53
UART2_RTS: B2.57
UART2_RX: B2.59
UART2_TX: B2.55
UART3_CTS: B2.33
UART3_RX: B2.35
UART3_TX: B2.28
USB0-DRVVBUS: B1.42
USB0-IDDET: B2.60
USB0_N: B2.51
USB0_P: B2.52
USB1_N: B2.49
USB1_P: B2.50
USB2_N: B2.47
USB2_P: B2.48
USB3_N: SH1.2
USB3_P: SH1.3
VCC-IO-EN: B1.40
NetC53_1: C53.1 U8.10(V3)
NetR33_2: R33.2 USB1.A5(CC1)
NetR34_2: R34.2 USB1.B5(CC2)

Not connected (* = marked no-connect by the designer): U8 4(RTS#)* 5(CTS#)* 6(TNOW)*; USB1 1(SHELL)* 2(SHELL)* 3(SHELL)* 4(SHELL)* A8(SBU1)* B8(SBU2)*

### Notes on the sheet
- 音频输入
- HDMI信号
- 以太网信号
- 电源控制数据引脚
- 可用于按键唤醒
- 音频输出
- OTG USB设备供电控制 未连接

### Library data of the parts
B1 B2 = BTB0.8-60: 板对板连接器 总高度5mm
C53 C54 = Chip capacitor: 贴片电容
C55-C57 = Cap Chip 0805: 0805封装的电容; Published: 8-Jun-2000; Revision: July-2002: Re-released for DXP Platform.; Publisher: Altium Limited
R33 R34 = Chip resistor: 贴片电阻
SH1 = SH1.0-4P: 间距为1mm的端子
U8 = CH340E: usd转串口芯片 MSOP10封装
USB1 = Tpye-c 16P: 16P 封装的TYPE -c接口 4固定插脚 双向

## Nets that join several sheets
AGND: 2-core (7 pins), 3-Wifi-SD (5 pins)
AVCC: 1-Power (C10.2 L4.1 T6.1), 2-core (C31.2 U6.G9 U6.V3)
GND: 1-Power (23 pins), 2-core (134 pins), 3-Wifi-SD (25 pins), 4-Connect (45 pins)
RTC-VIO: 1-Power (7 pins), 2-core (26 pins), 3-Wifi-SD (C67.1 CARD1.4 R44.2 R45.2)
USB-5V: 1-Power (10 pins), 3-Wifi-SD (6 pins), 4-Connect (12 pins)
VCC-CPU-1.5V: 1-Power (5 pins), 2-core (17 pins)
VCC-DRAM: 1-Power (C9.2 L5.2 R11.2 T4.1), 2-core (39 pins)
VCC-RTC: 1-Power (6 pins), 2-core (U6.K6)
VCC-SYS-1.2V: 1-Power (5 pins), 2-core (16 pins)
VDD-EPHY: 1-Power (R5.2 T3.1), 2-core (C39.2 U6.F8)
AFCC_EN: 2-core (U6.B1), 4-Connect (B1.57)
CAM_D0: 2-core (U6.C9), 4-Connect (B2.42)
CAM_D1: 2-core (U6.E10), 4-Connect (B2.36)
CAM_D2: 2-core (U6.D10), 4-Connect (B2.40)
CAM_D3: 2-core (U6.C8), 4-Connect (B2.44)
CAM_D4: 2-core (U6.C11), 4-Connect (B2.39)
CAM_D5: 2-core (U6.C12), 4-Connect (B2.38)
CAM_D6: 2-core (U6.E8), 4-Connect (B2.45)
CAM_D7: 2-core (U6.A11), 4-Connect (B2.13)
CAM_HSYNC: 2-core (U6.B11), 4-Connect (B2.15)
CAM_MCLK: 2-core (U6.A10), 4-Connect (B2.12)
CAM_PCLK: 2-core (U6.B10), 4-Connect (B2.14)
CAM_VSYNC: 2-core (U6.C10), 4-Connect (B2.41)
CSI-PWR-EN: 2-core (U6.C14), 4-Connect (B2.21)
CSI_EN: 2-core (U6.D2), 4-Connect (B2.1)
EPHY-LINK-LED: 2-core (C32.2 U6.A2), 4-Connect (B2.10)
EPHY-RX_N: 2-core (U6.A4), 4-Connect (B2.8)
EPHY-RX_P: 2-core (U6.B4), 4-Connect (B2.9)
EPHY-SPD-LED: 2-core (C33.2 U6.F7), 4-Connect (B2.11)
EPHY-TX_N: 2-core (U6.A3), 4-Connect (B2.6)
EPHY-TX_P: 2-core (U6.B3), 4-Connect (B2.7)
GPIOA6: 2-core (U6.E14), 4-Connect (B2.34)
GPIOA7: 2-core (U6.D8), 4-Connect (B2.43)
GPIOA8: 2-core (U6.F13), 4-Connect (B2.26)
GPIOA9: 2-core (U6.D13), 4-Connect (B2.31)
GPIOA10: 2-core (U6.E11), 4-Connect (B2.32)
GPIOA20: 2-core (U6.A13), 4-Connect (B2.17)
GPIOA21: 2-core (U6.A14), 4-Connect (B2.19)
GPIOL3/K1: 2-core (U6.R1), 4-Connect (B1.41)
GPIOL8/PWR-STB: 1-Power (R3.1 U2.8 U3.1), 2-core (U6.T2)
GPIOL9/PWR-DRAM: 1-Power (R7.1 U4.1), 2-core (U6.M6)
HCEC: 2-core (U6.G5), 4-Connect (B1.46)
HHPD: 2-core (U6.M2), 4-Connect (B1.45)
HSCL: 2-core (U6.H3), 4-Connect (B1.48)
HSDA: 2-core (U6.K3), 4-Connect (B1.47)
HTX0_N: 2-core (U6.F1), 4-Connect (B1.54)
HTX0_P: 2-core (U6.G1), 4-Connect (B1.53)
HTX1_N: 2-core (U6.G2), 4-Connect (B1.52)
HTX1_P: 2-core (U6.H2), 4-Connect (B1.51)
HTX2_N: 2-core (U6.J2), 4-Connect (B1.50)
HTX2_P: 2-core (U6.J1), 4-Connect (B1.49)
HTXC_N: 2-core (U6.E2), 4-Connect (B1.56)
HTXC_P: 2-core (U6.F2), 4-Connect (B1.55)
I2C0_SCL: 2-core (U6.F11), 4-Connect (B2.29)
I2C0_SDA: 2-core (U6.C13), 4-Connect (B2.37)
I2C1_SCL: 2-core (U6.B13), 4-Connect (B2.18)
I2C1_SDA: 2-core (U6.B14), 4-Connect (B2.20)
I2C2_SCL: 2-core (U6.B12), 4-Connect (B2.16)
I2C2_SDA: 2-core (U6.C7), 4-Connect (B2.46)
LINEOUTL: 2-core (U6.AA3), 3-Wifi-SD (C75.1 R51.1), 4-Connect (B1.38)
LINEOUTR: 2-core (U6.Y3), 4-Connect (B1.39)
MBIAS: 2-core (U6.W3), 3-Wifi-SD (C68.2 R46.2), 4-Connect (B1.60)
MICIN1_N: 2-core (U6.Y1), 3-Wifi-SD (C72.2), 4-Connect (B1.58)
MICIN1_P: 2-core (U6.W2), 3-Wifi-SD (C70.2), 4-Connect (B1.59)
PC4: 2-core (U6.F16), 4-Connect (B2.27)
PC7: 2-core (U6.A16), 4-Connect (B2.23)
S-TWI-SCK: 2-core (U6.N1), 4-Connect (B1.43)
S-TWI-SDA: 2-core (U6.M1), 4-Connect (B1.44)
SDC0-CLK: 2-core (U6.D20), 3-Wifi-SD (R47.2)
SDC0-CMD: 2-core (U6.F18), 3-Wifi-SD (CARD1.3 R45.1)
SDC0-D0: 2-core (U6.A19), 3-Wifi-SD (CARD1.7)
SDC0-D1: 2-core (U6.D19), 3-Wifi-SD (CARD1.8)
SDC0-D2: 2-core (U6.C20), 3-Wifi-SD (CARD1.1)
SDC0-D3: 2-core (U6.E21), 3-Wifi-SD (CARD1.2)
SDC0-DET: 2-core (U6.G18), 3-Wifi-SD (CARD1.9 R44.1)
SPI0_CLK: 2-core (U6.B16), 4-Connect (B2.24)
SPI0_CS: 2-core (U6.B15), 4-Connect (B2.22)
SPI0_MISO: 2-core (U6.C16), 4-Connect (B2.25)
SPI0_MOSI: 2-core (U6.C15), 4-Connect (B2.30)
UART0_RX: 2-core (U6.H6), 4-Connect (B2.56 U8.8)
UART0_TX: 2-core (U6.F5), 4-Connect (B2.58 U8.9)
UART1_CTS: 2-core (U6.E3), 4-Connect (B2.4)
UART1_RTS: 2-core (U6.C3), 4-Connect (B2.2)
UART1_RX: 2-core (U6.D3), 4-Connect (B2.3)
UART1_TX: 2-core (U6.G4), 4-Connect (B2.5)
UART2_CTS: 2-core (U6.E13), 4-Connect (B2.53)
UART2_RTS: 2-core (U6.D6), 4-Connect (B2.57)
UART2_RX: 2-core (U6.D5), 4-Connect (B2.59)
UART2_TX: 2-core (U6.D11), 4-Connect (B2.55)
UART3_CTS: 2-core (U6.D15), 4-Connect (B2.33)
UART3_RX: 2-core (U6.G12), 4-Connect (B2.35)
UART3_TX: 2-core (U6.E15), 4-Connect (B2.28)
USB0-DRVVBUS: 2-core (U6.P2), 4-Connect (B1.42)
USB0-IDDET: 2-core (U6.D1), 4-Connect (B2.60)
USB0_N: 2-core (U6.B5), 4-Connect (B2.51)
USB0_P: 2-core (U6.A5), 4-Connect (B2.52)
USB1_N: 2-core (U6.B7), 4-Connect (B2.49)
USB1_P: 2-core (U6.B6), 4-Connect (B2.50)
USB2_N: 2-core (U6.A8), 4-Connect (B2.47)
USB2_P: 2-core (U6.A7), 4-Connect (B2.48)
USB3_N: 2-core (U6.B9), 4-Connect (SH1.2)
USB3_P: 2-core (U6.B8), 4-Connect (SH1.3)
VCC-IO-EN: 2-core (U6.R2), 4-Connect (B1.40)
VDD_CPUFB: 1-Power (C5.2 R4.1 R6.2), 2-core (U6.T10)
WL-PMU-EN: 2-core (U6.T3), 3-Wifi-SD (R35.1 U9.10)
WL-SDIO-CLK: 2-core (U6.J3), 3-Wifi-SD (U9.16)
WL-SDIO-CMD: 2-core (U6.L2), 3-Wifi-SD (R39.1 U9.15)
WL-SDIO-D0: 2-core (U6.H4), 3-Wifi-SD (R40.1 U9.17)
WL-SDIO-D1: 2-core (U6.F3), 3-Wifi-SD (R41.1 U9.18)
WL-SDIO-D2: 2-core (U6.C2), 3-Wifi-SD (R37.1 U9.13)
WL-SDIO-D3: 2-core (U6.C1), 3-Wifi-SD (R38.1 U9.14)
WL-WAKE-AP: 2-core (U6.M3), 3-Wifi-SD (R36.1 U9.20)